# Altium schematic sheet ESC.SchDoc
size B; DocumentNumber: 5; Revision: 1.1; SheetNumber: 4; SheetTotal: 7
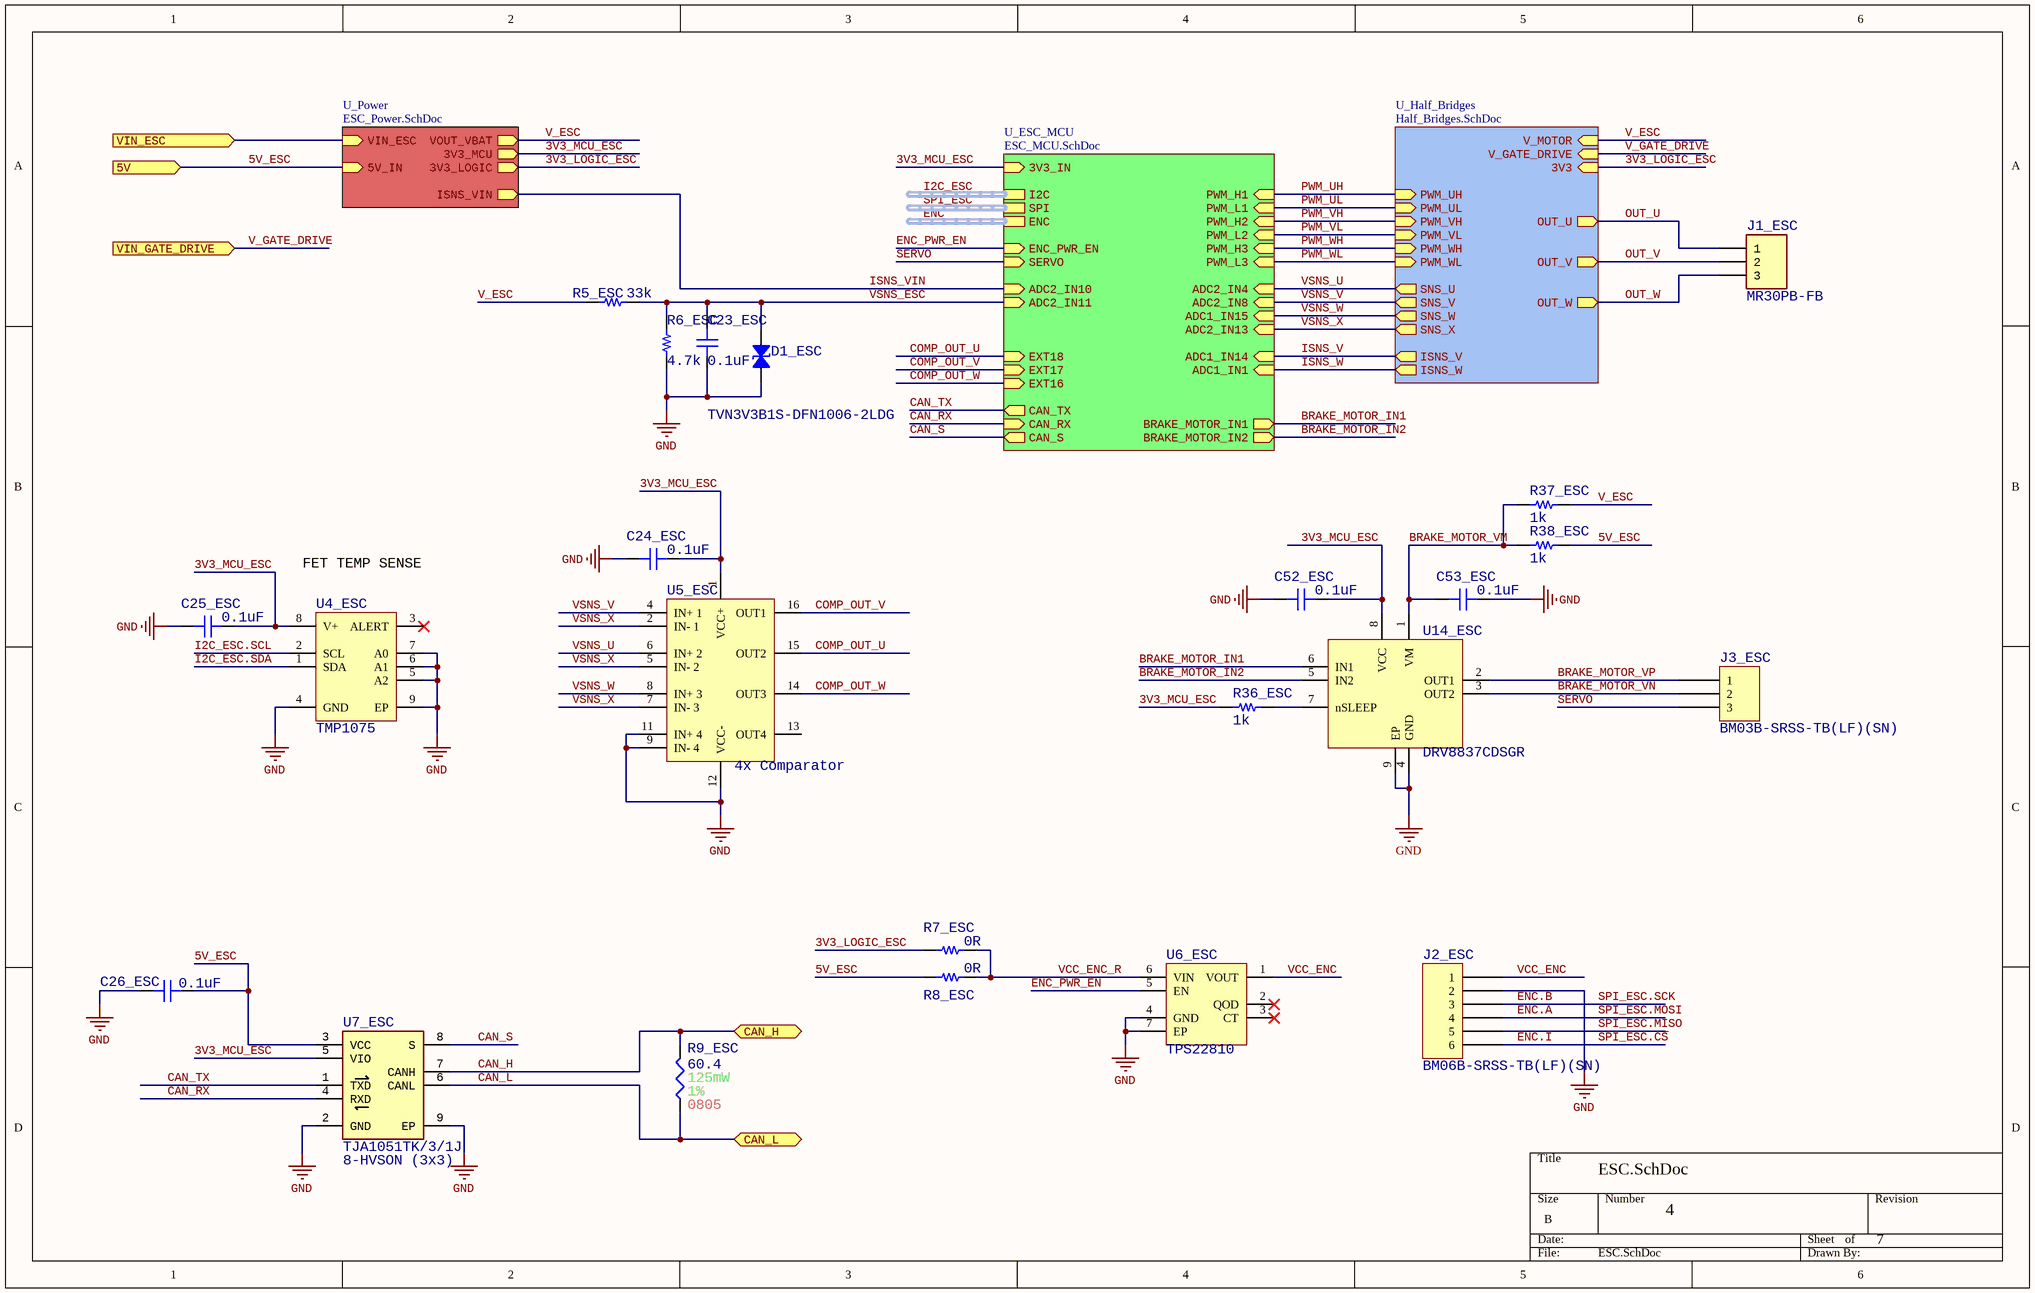
[diagram p0: ESC.SchDoc]

## Parts
C23_ESC  0.1uF  [CAP_0402]
C24_ESC  0.1uF  [CAP_0402]
C25_ESC  0.1uF  [CAP_0402]
C26_ESC  0.1uF  [CAP_0402]
C52_ESC  0.1uF  [CAP_0402]
C53_ESC  0.1uF  [CAP_0402]
D1_ESC  TVN3V3B1S-DFN1006-2LDG  [0402]
J1_ESC  MR30PB-FB  [MR30PB-F]
J2_ESC  BM06B-SRSS-TB(LF)(SN)  [JST BM06B-SRSS-TB]
J3_ESC  BM03B-SRSS-TB(LF)(SN)  [JST BM03B-SRSS-TB]
R5_ESC  33k  [RES_0402]
R6_ESC  4.7k  [RES_0402]
R7_ESC  0R  [RES_0402]
R8_ESC  0R  [RES_0402]
R9_ESC  value 60.4  Power: 125mW  Tolerance: 1%  Case/Package: 0805  [0805 Resistor]  (hidden comment: TFA0805R60R4F-T5)
R36_ESC  1k  [RES_0402]
R37_ESC  1k  [RES_0402]
R38_ESC  1k  [RES_0402]
U4_ESC  TMP1075  [8-WSON_2x2_0.5mm]
U5_ESC  4x Comparator  [QFN50P300X300X100-16N]
U6_ESC  TPS22810  [6-WSON_2x2_0.65mm]
U7_ESC  TJA1051TK/3/1J  Case/Package: 8-HVSON (3x3)  [TJA1044xxK]
U14_ESC  DRV8837CDSGR  [SON50P200X200X80-9N]

## Sub-sheets
U_ESC_MCU = ESC_MCU.SchDoc: I2C (harness I2C), PWM_L1 (in), PWM_H1 (in), PWM_L2 (in), PWM_H2 (in), PWM_L3 (in), PWM_H3 (in), ENC (harness ENC), ADC1_IN1 (in), ADC1_IN14 (in), EXT16 (in), EXT17 (in), EXT18 (in), ADC2_IN10 (in), SPI (harness SPI), ENC_PWR_EN (in), ADC2_IN11 (in), ADC2_IN4 (in), ADC2_IN8 (in), ADC2_IN13 (in), ADC1_IN15 (in), SERVO (in), CAN_TX (out), CAN_RX (in), CAN_S (out), 3V3_IN (in), BRAKE_MOTOR_IN1 (out), BRAKE_MOTOR_IN2 (out)
U_Half_Bridges = Half_Bridges.SchDoc: PWM_UH (in), PWM_UL (in), PWM_VH (in), PWM_VL (in), PWM_WH (in), PWM_WL (in), SNS_U (out), SNS_V (out), SNS_W (out), SNS_X (out), OUT_U (out), OUT_V (out), OUT_W (out), ISNS_V (out), ISNS_W (out), V_MOTOR (in), V_GATE_DRIVE (in), 3V3 (in)
U_Power = ESC_Power.SchDoc: ISNS_VIN (out), VIN_ESC (in), VOUT_VBAT (out), 5V_IN (in), 3V3_MCU (out), 3V3_LOGIC (out)

## Ports
5V (in), CAN_H (bidir), CAN_L (bidir), VIN_ESC (in), VIN_GATE_DRIVE (in)

## Nets
GND: C23_ESC.1 C24_ESC.1 C25_ESC.1 C26_ESC.2 C52_ESC.1 C53_ESC.2 D1_ESC.1 J2_ESC.2 R6_ESC.2 U4_ESC.4(GND) U4_ESC.5(A2) U4_ESC.6(A1) U4_ESC.7(A0) U4_ESC.9(EP) U5_ESC.9(IN-_4) U5_ESC.11(IN+_4) U5_ESC.12(VCC-) U6_ESC.4(GND) U6_ESC.7(EP) U7_ESC.2(GND) U7_ESC.9(EP) U14_ESC.4(GND) U14_ESC.9(EP)
3V3_LOGIC_ESC: R7_ESC.2 ; sheet U_Power/3V3_LOGIC, sheet U_Half_Bridges/3V3
3V3_MCU_ESC: C24_ESC.2 C25_ESC.2 C52_ESC.2 R36_ESC.1 U4_ESC.8(V+) U5_ESC.1(VCC+) U7_ESC.5(VIO) U14_ESC.8(VCC) ; sheet U_ESC_MCU/3V3_IN, sheet U_Power/3V3_MCU
5V_ESC: C26_ESC.1 R8_ESC.2 R38_ESC.2 U7_ESC.3(VCC) ; port 5V, sheet U_Power/5V_IN
BRAKE_MOTOR_IN1: U14_ESC.6(IN1) ; sheet U_ESC_MCU/BRAKE_MOTOR_IN1
BRAKE_MOTOR_IN2: U14_ESC.5(IN2) ; sheet U_ESC_MCU/BRAKE_MOTOR_IN2
BRAKE_MOTOR_VM: C53_ESC.1 R37_ESC.1 R38_ESC.1 U14_ESC.1(VM)
BRAKE_MOTOR_VN: J3_ESC.2 U14_ESC.3(OUT2)
BRAKE_MOTOR_VP: J3_ESC.1 U14_ESC.2(OUT1)
CAN_H: R9_ESC.2 U7_ESC.7(CANH) ; port CAN_H
CAN_L: R9_ESC.1 U7_ESC.6(CANL) ; port CAN_L
CAN_RX: U7_ESC.4(RXD) ; sheet U_ESC_MCU/CAN_RX
CAN_S: U7_ESC.8(S) ; sheet U_ESC_MCU/CAN_S
CAN_TX: U7_ESC.1(TXD) ; sheet U_ESC_MCU/CAN_TX
COMP_OUT_U: U5_ESC.15(OUT2) ; sheet U_ESC_MCU/EXT18
COMP_OUT_V: U5_ESC.16(OUT1) ; sheet U_ESC_MCU/EXT17
COMP_OUT_W: U5_ESC.14(OUT3) ; sheet U_ESC_MCU/EXT16
ENC.A: J2_ESC.4  [also labelled SPI_ESC.MOSI]
ENC.B: J2_ESC.3  [also labelled SPI_ESC.SCK]
ENC.I: J2_ESC.6  [also labelled SPI_ESC.~{CS}]
ENC_PWR_EN: U6_ESC.5(EN) ; sheet U_ESC_MCU/ENC_PWR_EN
I2C_ESC.SCL: U4_ESC.2(SCL)
I2C_ESC.SDA: U4_ESC.1(SDA)
ISNS_V: sheet U_ESC_MCU/ADC1_IN14, sheet U_Half_Bridges/ISNS_V
ISNS_VIN: sheet U_ESC_MCU/ADC2_IN10, sheet U_Power/ISNS_VIN
ISNS_W: sheet U_ESC_MCU/ADC1_IN1, sheet U_Half_Bridges/ISNS_W
OUT_U: J1_ESC.1 ; sheet U_Half_Bridges/OUT_U
OUT_V: J1_ESC.2 ; sheet U_Half_Bridges/OUT_V
OUT_W: J1_ESC.3 ; sheet U_Half_Bridges/OUT_W
PWM_UH: sheet U_ESC_MCU/PWM_H1, sheet U_Half_Bridges/PWM_UH
PWM_UL: sheet U_ESC_MCU/PWM_L1, sheet U_Half_Bridges/PWM_UL
PWM_VH: sheet U_ESC_MCU/PWM_H2, sheet U_Half_Bridges/PWM_VH
PWM_VL: sheet U_ESC_MCU/PWM_L2, sheet U_Half_Bridges/PWM_VL
PWM_WH: sheet U_ESC_MCU/PWM_H3, sheet U_Half_Bridges/PWM_WH
PWM_WL: sheet U_ESC_MCU/PWM_L3, sheet U_Half_Bridges/PWM_WL
SERVO: J3_ESC.3 ; sheet U_ESC_MCU/SERVO
SPI_ESC.MISO: J2_ESC.5
V_ESC: R5_ESC.2 R37_ESC.2 ; sheet U_Power/VOUT_VBAT, sheet U_Half_Bridges/V_MOTOR
V_GATE_DRIVE: port VIN_GATE_DRIVE, sheet U_Half_Bridges/V_GATE_DRIVE
VCC_ENC: J2_ESC.1 U6_ESC.1(VOUT)
VCC_ENC_R: R7_ESC.1 R8_ESC.1 U6_ESC.6(VIN)
VIN_ESC: port VIN_ESC, sheet U_Power/VIN_ESC
VSNS_ESC: C23_ESC.2 D1_ESC.2 R5_ESC.1 R6_ESC.1 ; sheet U_ESC_MCU/ADC2_IN11
VSNS_U: U5_ESC.6(IN+_2) ; sheet U_ESC_MCU/ADC2_IN4, sheet U_Half_Bridges/SNS_U
VSNS_V: U5_ESC.4(IN+_1) ; sheet U_ESC_MCU/ADC2_IN8, sheet U_Half_Bridges/SNS_V
VSNS_W: U5_ESC.8(IN+_3) ; sheet U_ESC_MCU/ADC1_IN15, sheet U_Half_Bridges/SNS_W
VSNS_X: U5_ESC.2(IN-_1) U5_ESC.5(IN-_2) U5_ESC.7(IN-_3) ; sheet U_ESC_MCU/ADC2_IN13, sheet U_Half_Bridges/SNS_X
NetR36_ESC_2: R36_ESC.2 U14_ESC.7(nSLEEP)

Not connected (* = marked no-connect by the designer): U4_ESC 3(ALERT)*; U5_ESC 13(OUT4); U6_ESC 2(QOD)* 3(CT)*

## Buses and harness runs
harness ENC = sheet U_ESC_MCU/ENC
harness I2C_ESC = sheet U_ESC_MCU/I2C
harness SPI_ESC = sheet U_ESC_MCU/SPI

## Notes on the sheet
- FET TEMP SENSE

## Library data of the parts
C23_ESC C24_ESC C25_ESC C26_ESC C52_ESC C53_ESC = CAP_0402: CAP CER 402; Value: 0.1uF
D1_ESC = TVN3V3B1S-DFN1006-2LDG: TVS DIODE 3.3V 14.2PF DFN1006; Manufacturer: INPAQ Technology Co., Ltd; Bidirectional Channels: 1; Capacitance @ Frequency: 11.5pF @ 1MHz; Current - Peak Pulse (10/1000µs): 8A (8/20µs); Power Line Protection: No; Type: Zener; Voltage - Breakdown (Min): 4V; Voltage - Clamping (Max) @ Ipp: 6.6V (Typ); Voltage - Reverse Standoff (Typ): 3.3V (Max); Part Number: TVN3V3B1S-DFN1006-2LDG; Applications: General Purpose; ComponentLink1Description: Datasheet; ComponentLink1URL: https://mm.digikey.com/Volume0/opasdata/d220001/medias/docus/5383/TVN3V3B1S-DFN1006-2LDG.pdf; ComponentLink2Description: DigiKey Link; ComponentLink2URL: https://www.digikey.com/en/products/detail/inpaq-technology-co-ltd/TVN3V3B1S-DFN1006-2LDG/20486686; Device Package: 0402 (1005 Metric); LastUpdated: 6/3/2024 8:22:57 PM; Lifecycle Status: Active; Minimum Order: 1; Mounting Type: Surface Mount; Operating Temperature: 150°C (TJ); Package / Case: 0402 (1005 Metric); Packaging: TapeAndReel; PartId: 11821; Price: 0.02; Series: TVN; Supplier 1: DigiKey; Supplier Part Number 1: 3526-TVN3V3B1S-DFN1006-2LDGCT-ND; Supplier Device Package: DFN1006
J1_ESC = CMP-002-00125-1: Vertical 3 pin barrel connector; Manufacturer: Amass; Gender: Female; Max Current Rating: 30A; Pins: 3
J2_ESC = BM06B-SRSS-TB(LF)(SN): CONN HEADER SMD 6POS 1MM; Manufacturer: JST Sales America Inc.; Current Rating (Amps): 0.7A; Material Flammability Rating: UL94 V-0; Number of Positions: 6; Number of Positions Loaded: All; Pitch - Mating: 0.039" (1.00mm); Shrouding: Shrouded - 4 Wall; Style: Board to Cable/Wire; Voltage Rating: 50V; Part Number: BM06B-SRSS-TB(LF)(SN); ComponentLink1Description: Datasheet; ComponentLink1URL: http://www.jst-mfg.com/product/pdf/eng/eSH.pdf; ComponentLink2Description: DigiKey Link; ComponentLink2URL: http://digikey.com/product-detail/en/jst-sales-america-inc/BM06B-SRSS-TB-LF-SN/455-1792-1-ND/926863; Connector Type: Header; Contact Finish - Mating: Tin; Contact Finish - Post: Tin; Contact Material: Copper Alloy; Contact Shape: Square; Contact Type: Male Pin; Fastening Type: Push-Pull; Features: Solder Retention; Insulation Color: Natural; Insulation Height: 0.167" (4.25mm); Insulation Material: Polyamide (PA), Nylon; LastUpdated: 1/12/2020 10:14:30 PM; Lifecycle Status: Active; Minimum Order: 1; Mounting Type: Surface Mount; Number of Rows: 1; Operating Temperature: -25°C ~ 85°C; Packaging: TapeAndReel; PartId: 20; Part Status: Active; Price: 0.38; Series: SR; Supplier 1: DigiKey; Supplier Part Number 1: 455-1792-1-ND; Termination: Solder
J3_ESC = BM03B-SRSS-TB(LF)(SN): CONN HEADER SMD 3POS 1MM; Manufacturer: JST Sales America Inc.; Current Rating (Amps): 0.7A; Material Flammability Rating: UL94 V-0; Number of Positions: 3; Number of Positions Loaded: All; Pitch - Mating: 0.039" (1.00mm); Shrouding: Shrouded - 4 Wall; Style: Board to Cable/Wire; Voltage Rating: 50V; Part Number: BM03B-SRSS-TB(LF)(SN); ComponentLink1Description: Datasheet; ComponentLink1URL: http://www.jst-mfg.com/product/pdf/eng/eSR.pdf; ComponentLink2Description: DigiKey Link; ComponentLink2URL: http://digikey.com/product-detail/en/jst-sales-america-inc/BM03B-SRSS-TB-LF-SN/455-1789-1-ND/926860; Connector Type: Header; Contact Finish - Mating: Tin; Contact Finish - Post: Tin; Contact Material: Copper Alloy; Contact Shape: Square; Contact Type: Male Pin; Fastening Type: Push-Pull; Features: Solder Retention; Insulation Color: Natural; Insulation Height: 0.167" (4.25mm); Insulation Material: Polyamide (PA), Nylon; LastUpdated: 1/12/2020 10:12:14 PM; Lifecycle Status: Active; Minimum Order: 1; Mounting Type: Surface Mount; Number of Rows: 1; Operating Temperature: -25°C ~ 85°C; Packaging: TapeAndReel; PartId: 14; Part Status: Active; Price: 0.24; Series: SR; Supplier 1: DigiKey; Supplier Part Number 1: 455-1789-1-ND; Termination: Solder
R5_ESC R6_ESC R7_ESC R8_ESC R36_ESC R37_ESC R38_ESC = RES_0402: RES 0402
R9_ESC = CMP-009-00189-2: Res 60.4 Ohm 1% 1/8W 0805; AECQ: Yes; Manufacturer Part Number: TFA0805R60R4F-T5; Mounting Technology: SMD; Pins: 2
U4_ESC = TMP1075: I2C TEMP SENSOR
U5_ESC = LM2901Q4T: Comparator General Purpose CMOS, DTL, MOS, Open-Collector, TTL 16-QFN (3x3)
U6_ESC = TPS22810DRVR: Load switch TPS22810DRVR
U7_ESC = CMP-031-00007-3: Interface Circuit, PDSO8; AECQ: Yes; Max Operating Temperature: 150°C; Pins: 8; Min Operating Temperature: -40°C
U14_ESC = DRV8837CDSGR: 11-V, 1-A H-bridge motor driver 8-WSON -40 to 85; MF: Texas Instruments; Mouser-Purchase-URL: https://snapeda.com/shop?store=Mouser&id=617854; Value: *; DigiKey-Purchase-URL: https://snapeda.com/shop?store=DigiKey&id=617854; Package: WSON-8 Texas Instruments; Texas_Instruments-Purchase-URL: https://snapeda.com/shop?store=Texas+Instruments&id=617854; Price: None; MP: DRV8837CDSGR; SnapEDA_Link: https://www.snapeda.com/parts/DRV8837CDSGR/Texas%20Instruments/view-part/617854/?ref=snap; Availability: Good